# EAGLE schematic MyoWare Proto Shield (EAGLE 6.5.0)
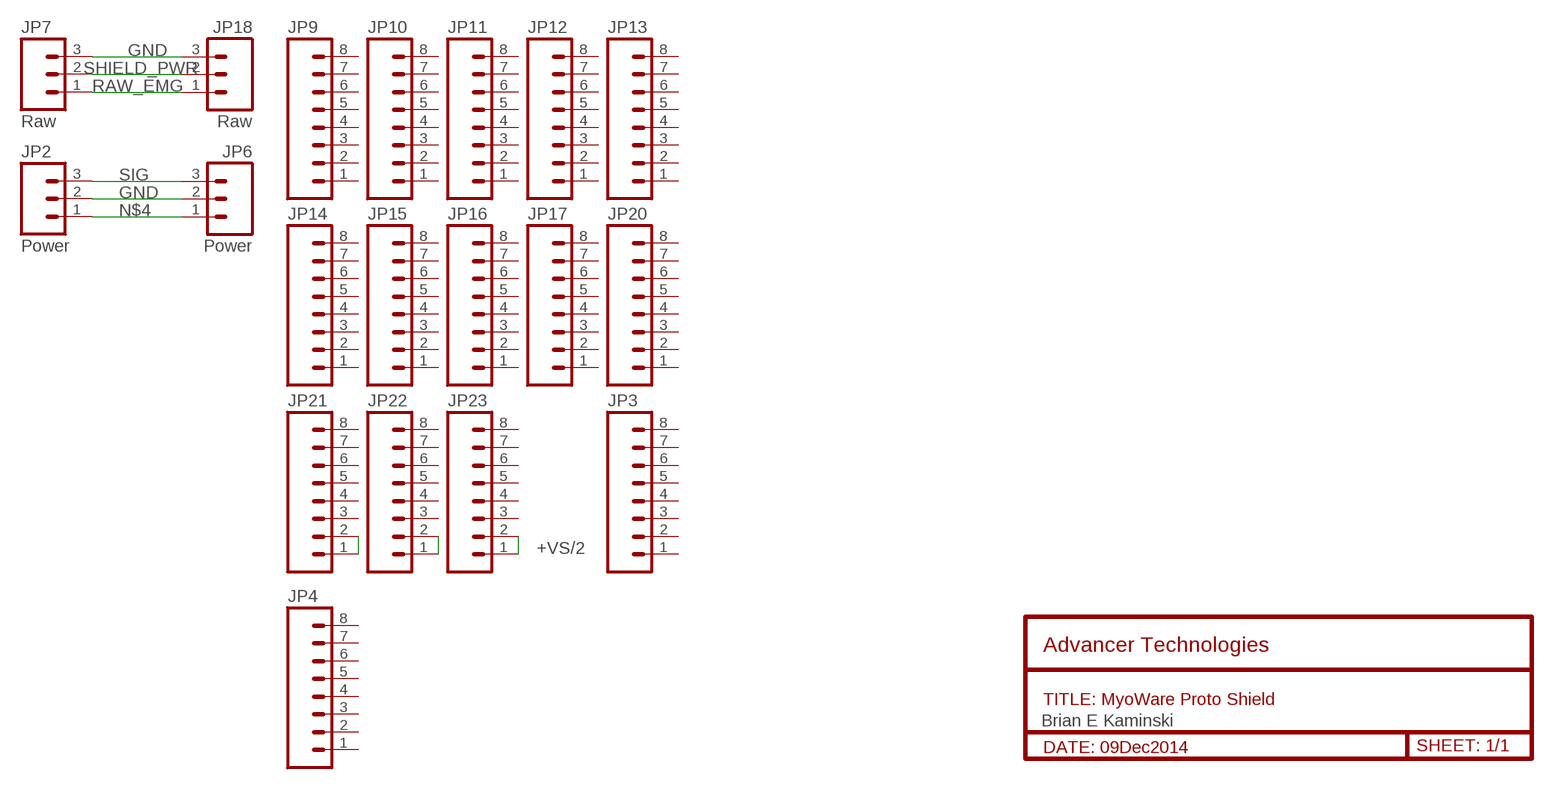
[diagram p0: schematic, sheet 1]

## Parts
JP2  Power  M031X03_NO_SILK  [1X03_NO_SILK]
JP3  M08NO_SILK  [1X08_NO_SILK]
JP4  M08NO_SILK  [1X08_NO_SILK]
JP6  Power  M031X03_NO_SILK  [1X03_NO_SILK]
JP7  Raw  M031X03_NO_SILK  [1X03_NO_SILK]
JP9  M08NO_SILK  [1X08_NO_SILK]
JP10  M08NO_SILK  [1X08_NO_SILK]
JP11  M08NO_SILK  [1X08_NO_SILK]
JP12  M08NO_SILK  [1X08_NO_SILK]
JP13  M08NO_SILK  [1X08_NO_SILK]
JP14  M08NO_SILK  [1X08_NO_SILK]
JP15  M08NO_SILK  [1X08_NO_SILK]
JP16  M08NO_SILK  [1X08_NO_SILK]
JP17  M08NO_SILK  [1X08_NO_SILK]
JP18  Raw  M031X03_NO_SILK  [1X03_NO_SILK]
JP20  M08NO_SILK  [1X08_NO_SILK]
JP21  M08NO_SILK  [1X08_NO_SILK]
JP22  M08NO_SILK  [1X08_NO_SILK]
JP23  M08NO_SILK  [1X08_NO_SILK]

## Nets
+VS/2: JP23.1 JP23.2
GND: JP2.2 JP6.2 JP7.3 JP18.3
N$3: JP21.1 JP21.2
N$4: JP2.1 JP6.1
N$5: JP22.1 JP22.2
RAW_EMG: JP7.1 JP18.1
SHIELD_PWR: JP7.2 JP18.2
SIG: JP2.3 JP6.3
Unconnected: JP3.1 JP3.2 JP3.3 JP3.4 JP3.5 JP3.6 JP3.7 JP3.8 JP4.1 JP4.2 JP4.3 JP4.4 JP4.5 JP4.6 JP4.7 JP4.8 JP9.1 JP9.2 JP9.3 JP9.4 JP9.5 JP9.6 JP9.7 JP9.8 JP10.1 JP10.2 JP10.3 JP10.4 JP10.5 JP10.6 JP10.7 JP10.8 JP11.1 JP11.2 JP11.3 JP11.4 JP11.5 JP11.6 JP11.7 JP11.8 JP12.1 JP12.2 JP12.3 JP12.4 JP12.5 JP12.6 JP12.7 JP12.8 JP13.1 JP13.2 JP13.3 JP13.4 JP13.5 JP13.6 JP13.7 JP13.8 JP14.1 JP14.2 JP14.3 JP14.4 JP14.5 JP14.6 JP14.7 JP14.8 JP15.1 JP15.2 JP15.3 JP15.4 JP15.5 JP15.6 JP15.7 JP15.8 JP16.1 JP16.2 JP16.3 JP16.4 JP16.5 JP16.6 JP16.7 JP16.8 JP17.1 JP17.2 JP17.3 JP17.4 JP17.5 JP17.6 JP17.7 JP17.8 JP20.1 JP20.2 JP20.3 JP20.4 JP20.5 JP20.6 JP20.7 JP20.8 JP21.3 JP21.4 JP21.5 JP21.6 JP21.7 JP21.8 JP22.3 JP22.4 JP22.5 JP22.6 JP22.7 JP22.8 JP23.3 JP23.4 JP23.5 JP23.6 JP23.7 JP23.8

## Notes on the sheet
- Advancer Technologies
- TITLE: MyoWare Proto Shield
- Brian E Kaminski
- DATE: 09Dec2014 | SHEET: 1/1

## Library data of the parts
JP2 JP6 JP7 JP18 = SparkFun-Connectors:M03: Header 3 Standard 3-pin 0.1" header. Use with straight break away headers (SKU : PRT-00116), right angle break away headers (PRT-00553), swiss pins (PRT-00743), machine pins (PRT-00117), and female headers (PRT-00115). Molex polarized connector foot print use with SKU : PRT-08232 with associated crimp pins and housings.
JP3 JP4 JP9-JP17 JP20-JP23 = SparkFun-Connectors:M08: Header 8 Standard 8-pin 0.1" header. Use with straight break away headers (SKU : PRT-00116), right angle break away headers (PRT-00553), swiss pins (PRT-00743), machine pins (PRT-00117), and female headers (PRT-00115).